# Altium schematic sheet P-MT3620RDB-1-0_Dev.SchDoc: MT3620 RDB Dev (part 1 of 2)
size A3; CompanyName: Microsoft Research; DrawnBy: Stuart Taylor; Revision: 1.0; SheetNumber: 5; SheetTotal: 5; ProjectName: MT3620 Reference Development Board
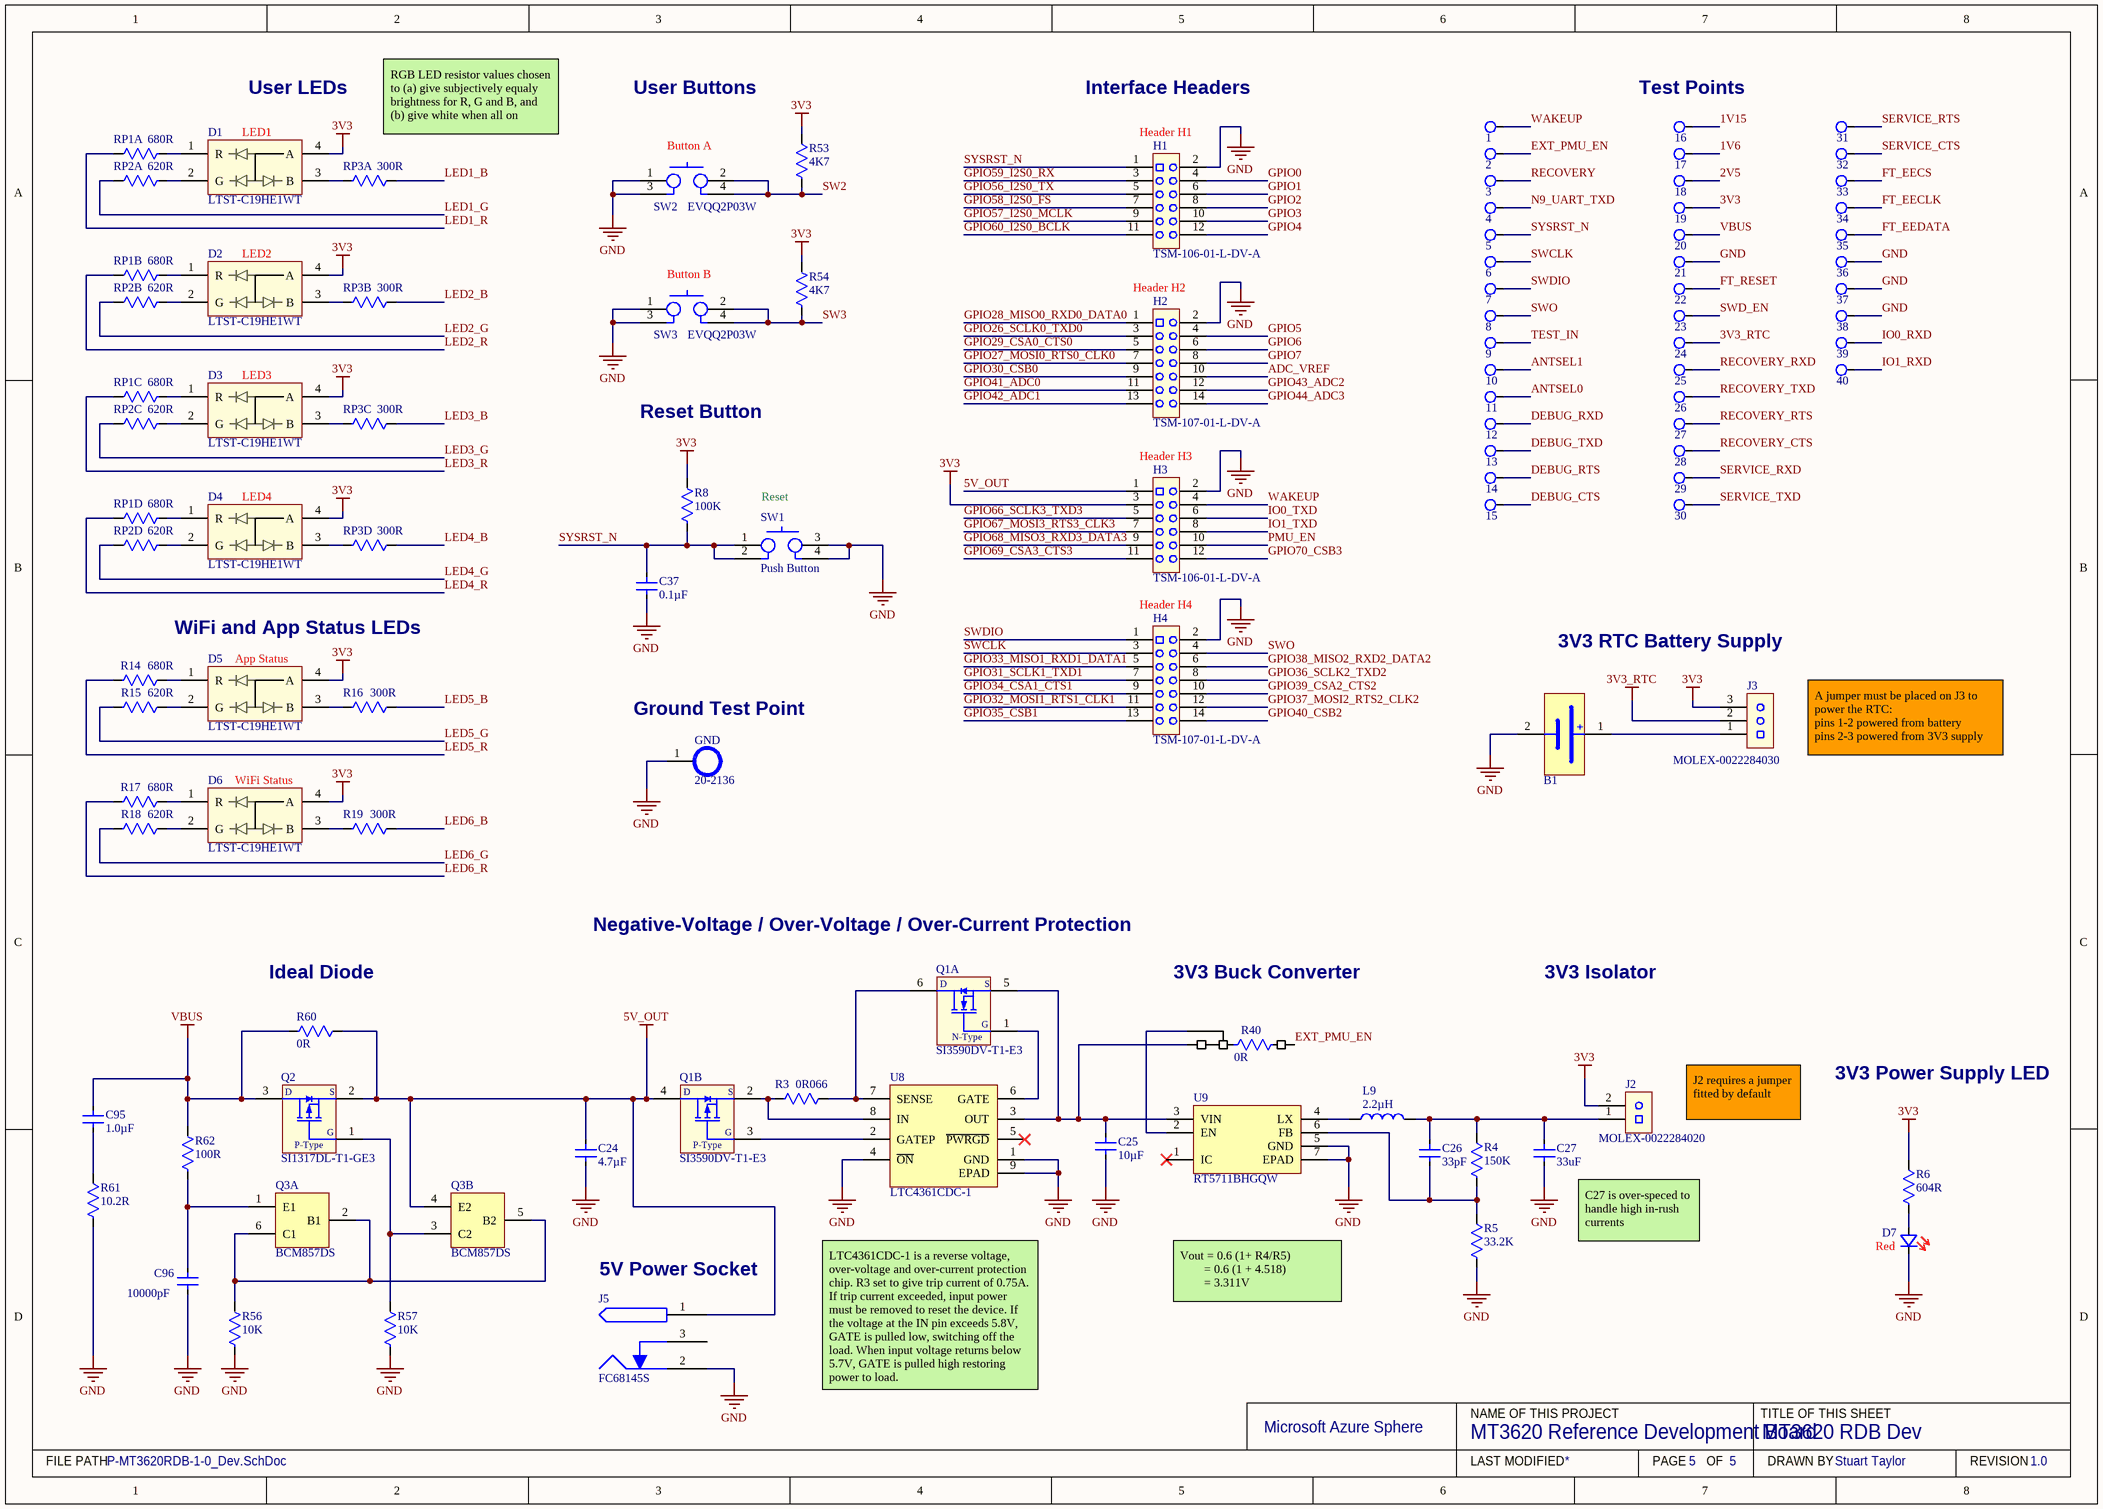
[diagram p0: P-MT3620RDB-1-0_Dev.SchDoc]

## Parts
1  TestPoint  [Pad1.27mm]  (value not drawn)  (no BOM)
2  TestPoint  [Pad1.27mm]  (value not drawn)  (no BOM)
3  TestPoint  [Pad1.27mm]  (value not drawn)  (no BOM)
4  TestPoint  [Pad1.27mm]  (value not drawn)  (no BOM)
5  TestPoint  [Pad1.27mm]  (value not drawn)  (no BOM)
6  TestPoint  [Pad1.27mm]  (value not drawn)  (no BOM)
7  TestPoint  [Pad1.27mm]  (value not drawn)  (no BOM)
8  TestPoint  [Pad1.27mm]  (value not drawn)  (no BOM)
9  TestPoint  [Pad1.27mm]  (value not drawn)  (no BOM)
10  TestPoint  [Pad1.27mm]  (value not drawn)  (no BOM)
11  TestPoint  [Pad1.27mm]  (value not drawn)  (no BOM)
12  TestPoint  [Pad1.27mm]  (value not drawn)  (no BOM)
13  TestPoint  [Pad1.27mm]  (value not drawn)  (no BOM)
14  TestPoint  [Pad1.27mm]  (value not drawn)  (no BOM)
15  TestPoint  [Pad1.27mm]  (value not drawn)  (no BOM)
16  TestPoint  [Pad1.27mm]  (value not drawn)  (no BOM)
17  TestPoint  [Pad1.27mm]  (value not drawn)  (no BOM)
18  TestPoint  [Pad1.27mm]  (value not drawn)  (no BOM)
19  TestPoint  [Pad1.27mm]  (value not drawn)  (no BOM)
20  TestPoint  [Pad1.27mm]  (value not drawn)  (no BOM)
21  TestPoint  [Pad1.27mm]  (value not drawn)  (no BOM)
22  TestPoint  [Pad1.27mm]  (value not drawn)  (no BOM)
23  TestPoint  [Pad1.27mm]  (value not drawn)  (no BOM)
24  TestPoint  [Pad1.27mm]  (value not drawn)  (no BOM)
25  TestPoint  [Pad1.27mm]  (value not drawn)  (no BOM)
26  TestPoint  [Pad1.27mm]  (value not drawn)  (no BOM)
27  TestPoint  [Pad1.27mm]  (value not drawn)  (no BOM)
28  TestPoint  [Pad1.27mm]  (value not drawn)  (no BOM)
29  TestPoint  [Pad1.27mm]  (value not drawn)  (no BOM)
30  TestPoint  [Pad1.27mm]  (value not drawn)  (no BOM)
31  TestPoint  [Pad1.27mm]  (value not drawn)  (no BOM)
32  TestPoint  [Pad1.27mm]  (value not drawn)  (no BOM)
33  TestPoint  [Pad1.27mm]  (value not drawn)  (no BOM)
34  TestPoint  [Pad1.27mm]  (value not drawn)  (no BOM)
35  TestPoint  [Pad1.27mm]  (value not drawn)  (no BOM)
36  TestPoint  [Pad1.27mm]  (value not drawn)  (no BOM)
37  TestPoint  [Pad1.27mm]  (value not drawn)  (no BOM)
38  TestPoint  [Pad1.27mm]  (value not drawn)  (no BOM)
39  TestPoint  [Pad1.27mm]  (value not drawn)  (no BOM)
40  TestPoint  [Pad1.27mm]  (value not drawn)  (no BOM)
B1  HARWIN-S8421-45R  [HARWIN-S8421-45R]  (value not drawn)
C24  4.7µF  [CAPC1005-EIA0402 0.55MM MED]
C25  10µF  [CAPC1608-EIA0603-1MM-MED]
C26  33pF  [CAPC1005-EIA0402 0.55MM MED]
C27  33uF  [TDK_0805]
C37  0.1µF  [CAPC1005-EIA0402 0.55MM MED]
C95  1.0µF  [CAPC1005-EIA0402 0.55MM MED]
C96  10000pF  [CAPC1005-EIA0402 0.55MM MED]
D1  LTST-C19HE1WT  [LTST-C19HE1WT]
D2  LTST-C19HE1WT  [LTST-C19HE1WT]
D3  LTST-C19HE1WT  [LTST-C19HE1WT]
D4  LTST-C19HE1WT  [LTST-C19HE1WT]
D5  LTST-C19HE1WT  [LTST-C19HE1WT]
D6  LTST-C19HE1WT  [LTST-C19HE1WT]
D7  Colour: Red  [Rohm SML-D12 Red]  (hidden comment: Red LED)
GND  20-2136  [20-2136]
H1  TSM-106-01-L-DV-A  [TSM-106-01-L-DV-A]
H2  TSM-107-01-L-DV-A  [TSM-107-01-L-DV-A]
H3  TSM-106-01-L-DV-A  [TSM-106-01-L-DV-A]
H4  TSM-107-01-L-DV-A  [TSM-107-01-L-DV-A]
J2  MOLEX-0022284020  [0022284020]
J3  MOLEX-0022284030  [0022284030]
J5  FC68145S  [FC68145S]
L9  2.2µH  [NR3015T2R2M]
Q1  SI3590DV-T1-E3  [SI3590DV-T1-E3]  (parts A,B of 2)
Q2  SI1317DL-T1-GE3  [VISHAY_SOT-323]
Q3  BCM857DS  [NXP-SOT457]  (parts A,B of 2)
R3  0R066  [VISHAY-0603]
R4  150K  [RES 0402 MEDIUM DENSITY]
R5  33.2K  [RES 0402 MEDIUM DENSITY]
R6  604R  [RES 0402 MEDIUM DENSITY]
R8  100K  [RES 0402 MEDIUM DENSITY]
R14  680R  [RES 0402 MEDIUM DENSITY]
R15  620R  [RES 0402 MEDIUM DENSITY]
R16  300R  [RES 0402 MEDIUM DENSITY]
R17  680R  [RES 0402 MEDIUM DENSITY]
R18  620R  [RES 0402 MEDIUM DENSITY]
R19  300R  [RES 0402 MEDIUM DENSITY]
R40  0R  [THREE-WAY-0402-WITH-SHORT]  (net tie, no BOM)
R53  4K7  [RES 0402 MEDIUM DENSITY]
R54  4K7  [RES 0402 MEDIUM DENSITY]
R56  10K  [RES 0402 MEDIUM DENSITY]
R57  10K  [RES 0402 MEDIUM DENSITY]
R60  0R  [RES 0402 MEDIUM DENSITY]
R61  10.2R  [RES 0402 MEDIUM DENSITY]
R62  100R  [RES 0402 MEDIUM DENSITY]
RP1  680R  [EXB-N8V]  (parts A,B,C,D of 4)
RP2  620R  [EXB-N8V]  (parts A,B,C,D of 4)
RP3  300R  [EXB-N8V]  (parts A,B,C,D of 4)
SW1  Push Button  [DHT-1158]
SW2  SWI TACT SPN0 PANASONIC EVQQ2P03W  [EVQQ2P03W]  (value not drawn)
SW3  SWI TACT SPN0 PANASONIC EVQQ2P03W  [EVQQ2P03W]  (value not drawn)
U8  LTC4361CDC-1  [LTC4361-1#TRPBF]
U9  RT5711BHGQW  [SON65P200X80_HS-7N]

## Nets
3V3: 19.1 D1.4(A) D2.4(A) D3.4(A) D4.4(A) D5.4(A) D6.4(A) H3.3 J2.2 J3.3 R6.1 R8.1 R53.1 R54.1
3V3_RTC: 24.1 J3.2
5V_OUT: C24.2 H3.1 J5.1 Q1.4(D2) Q2.2(S) Q3.4(E2) R60.1
GND: 21.1 36.1 37.1 38.1 B1.2(-) C24.1 C25.1 C27.1 C37.1 C96.1 D7.1(K) GND.1 H1.2 H2.2 H3.2 H4.2 J5.2 R5.2 R56.2 R57.2 R61.2 SW1.3 SW1.4 SW2.1 SW2.3 SW3.1 SW3.3 U8.1(GND) U8.4(~{ON}) U8.9(EPAD) U9.5(GND) U9.7(EPAD)
VBUS: 20.1 C95.2 Q2.3(D) R60.2 R62.1
1V6: 17.1
1V15: 16.1
2V5: 18.1
ADC_VREF: H2.10
ANTSEL0: 11.1
ANTSEL1: 10.1
DEBUG_CTS: 15.1
DEBUG_RTS: 14.1
DEBUG_RXD: 12.1
DEBUG_TXD: 13.1
EXT_PMU_EN: 2.1 R40.1
FT_EECLK: 34.1
FT_EECS: 33.1
FT_EEDATA: 35.1
FT_RESET: 22.1
GPIO0: H1.4
GPIO1: H1.6
GPIO2: H1.8
GPIO3: H1.10
GPIO4: H1.12
GPIO5: H2.4
GPIO6: H2.6
GPIO7: H2.8
GPIO26_SCLK0_TXD0: H2.3
GPIO27_MOSI0_RTS0_CLK0: H2.7
GPIO28_MISO0_RXD0_DATA0: H2.1
GPIO29_CSA0_CTS0: H2.5
GPIO30_CSB0: H2.9
GPIO31_SCLK1_TXD1: H4.7
GPIO32_MOSI1_RTS1_CLK1: H4.11
GPIO33_MISO1_RXD1_DATA1: H4.5
GPIO34_CSA1_CTS1: H4.9
GPIO35_CSB1: H4.13
GPIO36_SCLK2_TXD2: H4.8
GPIO37_MOSI2_RTS2_CLK2: H4.12
GPIO38_MISO2_RXD2_DATA2: H4.6
GPIO39_CSA2_CTS2: H4.10
GPIO40_CSB2: H4.14
GPIO41_ADC0: H2.11
GPIO42_ADC1: H2.13
GPIO43_ADC2: H2.12
GPIO44_ADC3: H2.14
GPIO56_I2S0_TX: H1.5
GPIO57_I2S0_MCLK: H1.9
GPIO58_I2S0_FS: H1.7
GPIO59_I2S0_RX: H1.3
GPIO60_I2S0_BCLK: H1.11
GPIO66_SCLK3_TXD3: H3.5
GPIO67_MOSI3_RTS3_CLK3: H3.7
GPIO68_MISO3_RXD3_DATA3: H3.9
GPIO69_CSA3_CTS3: H3.11
GPIO70_CSB3: H3.12
IO0_RXD: 39.1
IO0_TXD: H3.6
IO1_RXD: 40.1
IO1_TXD: H3.8
LED1_B: RP3.2
LED1_G: RP2.2
LED1_R: RP1.2
LED2_B: RP3.4
LED2_G: RP2.4
LED2_R: RP1.4
LED3_B: RP3.6
LED3_G: RP2.6
LED3_R: RP1.6
LED4_B: RP3.8
LED4_G: RP2.8
LED4_R: RP1.8
LED5_B: R16.1
LED5_G: R15.2
LED5_R: R14.2
LED6_B: R19.1
LED6_G: R18.2
LED6_R: R17.2
N9_UART_TXD: 4.1
PMU_EN: H3.10
RECOVERY: 3.1
RECOVERY_CTS: 28.1
RECOVERY_RTS: 27.1
RECOVERY_RXD: 25.1
RECOVERY_TXD: 26.1
SERVICE_CTS: 32.1
SERVICE_RTS: 31.1
SERVICE_RXD: 29.1
SERVICE_TXD: 30.1
SW2: R53.2 SW2.2 SW2.4
SW3: R54.2 SW3.2 SW3.4
SWCLK: 6.1 H4.3
SWD_EN: 23.1
SWDIO: 7.1 H4.1
SWO: 8.1 H4.4
SYSRST_N: 5.1 C37.2 H1.1 R8.2 SW1.1 SW1.2
TEST_IN: 9.1
WAKEUP: 1.1 H3.4
NetB1_1: B1.1(+) J3.1
NetC25_2: C25.2 Q1.5(S1) R40.3 U8.3(OUT) U9.3(VIN)
NetC26_1: C26.1 R4.2 R5.1 U9.6(FB)
NetC26_2: C26.2 C27.2 J2.1 L9.2 R4.1
NetC95_1: C95.1 R61.1
NetC96_2: C96.2 Q3.1(E1) R62.2
NetD1_1: D1.1(R) RP1.1
NetD1_2: D1.2(G) RP2.1
NetD1_3: D1.3(B) RP3.1
NetD2_1: D2.1(R) RP1.3
NetD2_2: D2.2(G) RP2.3
NetD2_3: D2.3(B) RP3.3
NetD3_1: D3.1(R) RP1.5
NetD3_2: D3.2(G) RP2.5
NetD3_3: D3.3(B) RP3.5
NetD4_1: D4.1(R) RP1.7
NetD4_2: D4.2(G) RP2.7
NetD4_3: D4.3(B) RP3.7
NetD5_1: D5.1(R) R14.1
NetD5_2: D5.2(G) R15.1
NetD5_3: D5.3(B) R16.2
NetD6_1: D6.1(R) R17.1
NetD6_2: D6.2(G) R18.1
NetD6_3: D6.3(B) R19.2
NetD7_2: D7.2(A) R6.2
NetL9_1: L9.1 U9.4(LX)
NetQ1_1: Q1.1(G1) U8.6(GATE)
NetQ1_2: Q1.2(S2) R3.2 U8.8(IN)
NetQ1_3: Q1.3(G2) U8.2(GATEP)
NetQ1_6: Q1.6(D1) R3.1 U8.7(SENSE)
NetQ2_1: Q2.1(G) Q3.3(C2) R57.1
NetQ3_2: Q3.2(B1) Q3.5(B2) Q3.6(C1) R56.1
NetR40_2: R40.2 U9.2(EN)

Not connected (* = marked no-connect by the designer): J5 3; U8 5(~{PWRGD})*; U9 1(IC)*

## Notes on the sheet
- User LEDs
- User Buttons
- Interface Headers
- (near 16) Test Points
- (near D1) LED1
- (near RP3) RGB LED resistor values chosen to (a) give subjectively equaly brightness for R, G and B, and (b) give white when all on
- (near SW2) Button A
- (near H1) Header H1
- (near D2) LED2
- (near SW3) Button B
- (near H2) Header H2
- (near D3) LED3
- Reset Button
- (near D4) LED4
- (near SW1) Reset
- (near H3) Header H3
- WiFi and App Status LEDs
- Header H4
- 3V3 RTC Battery Supply
- (near D5) App Status
- (near GND) Ground Test Point
- (near D6) WiFi Status
- A jumper must be placed on J3 to power the RTC:
  pins 1-2 powered from battery
  pins 2-3 powered from 3V3 supply
- (near R60) Ideal Diode
- Negative-Voltage / Over-Voltage / Over-Current Protection
- (near R40) 3V3 Buck Converter
- 3V3 Isolator
- J2 requires a jumper fitted by default
- 3V3 Power Supply LED
- C27 is over-speced to handle high in-rush currents
- (near J5) 5V Power Socket
- Vout = 0.6 (1+ R4/R5)
  = 0.6 (1 + 4.518)
  = 3.311V
- LTC4361CDC-1 is a reverse voltage, over-voltage and over-current protection chip. R3 set to give trip current of 0.75A. If trip current exceeded, input power must be removed to reset the device. If the voltage at the IN pin exceeds 5.8V, GATE is pulled low, switching off the load. When input voltage returns below 5.7V, GATE is pulled high restoring power to load.
- Microsoft Azure Sphere
- NAME OF THIS PROJECT
- TITLE OF THIS SHEET
- FILE PATH
- LAST MODIFIED
- PAGE
- OF
- DRAWN BY
- REVISION
- (in symbol SI1317DL-T1-GE3) P-Type
- (in symbol SI3590DV-T1-E3, part A) D; S; G; N-Type
- (in symbol SI3590DV-T1-E3, part B) D; S; G; P-Type